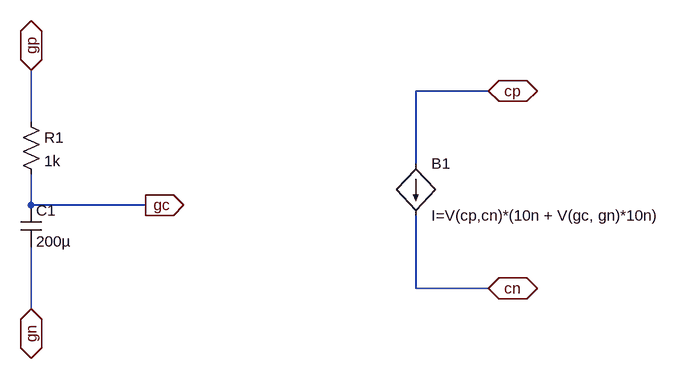
[diagram p0: schematic capteur_graphite.asc]
capteur_graphite.asc, the LTspice schematic file:
Version 4
SHEET 1 1052 680
WIRE 736 32 624 32
WIRE 32 80 32 0
WIRE 624 144 624 32
WIRE 32 208 32 160
WIRE 208 208 32 208
WIRE 624 336 624 224
WIRE 736 336 624 336
WIRE 32 368 32 272
FLAG 32 0 gp
IOPIN 32 0 BiDir
FLAG 32 368 gn
IOPIN 32 368 BiDir
FLAG 208 208 gc
IOPIN 208 208 Out
FLAG 736 32 cp
IOPIN 736 32 BiDir
FLAG 736 336 cn
IOPIN 736 336 BiDir
SYMBOL res 16 64 R0
SYMATTR InstName R1
SYMATTR Value 1k
SYMBOL cap 16 208 R0
SYMATTR InstName C1
SYMATTR Value 200µ
SYMBOL bi 624 144 R0
SYMATTR InstName B1
SYMATTR Value I=V(cp,cn)*(10n + V(gc, gn)*10n)

The netlist it stands for:
* capteur_graphite.asc
R1 gp gc 1k
C1 gc gn 200µ
B1 cp cn I=V(cp,cn)*(10n + V(gc, gn)*10n)
.backanno
.end